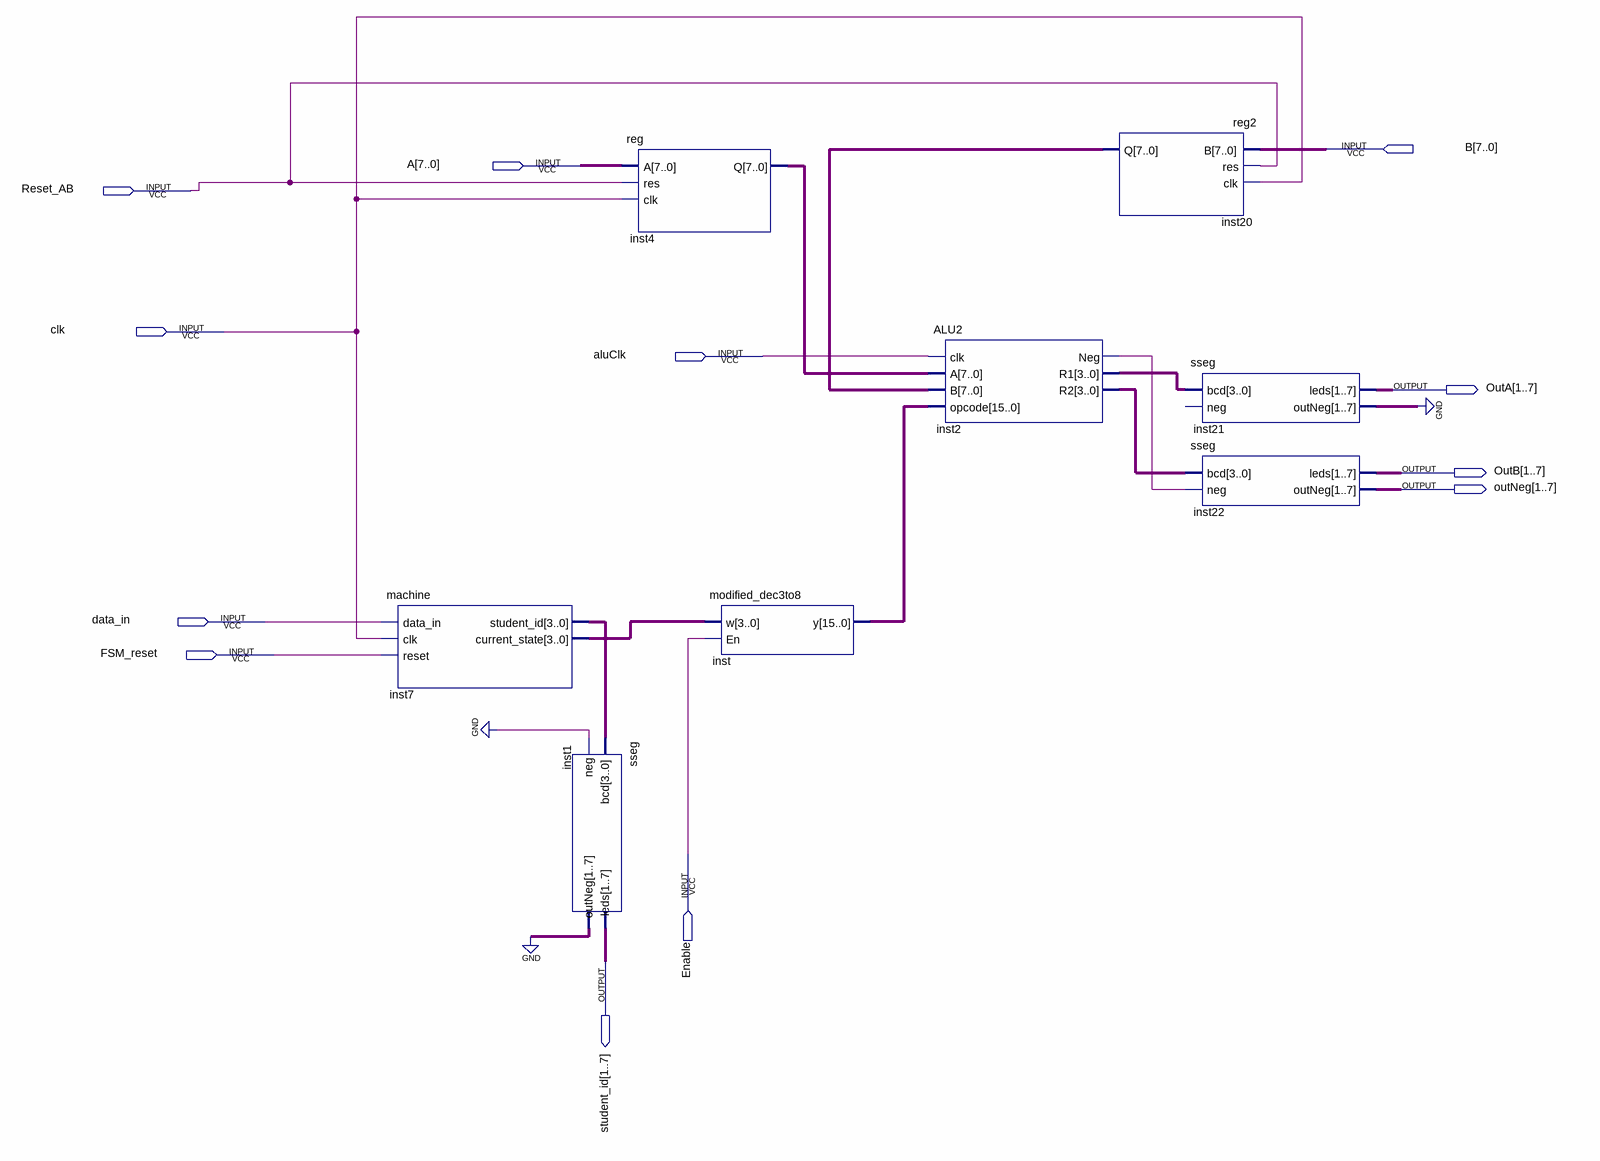
[diagram p0: schematic sheet]
// Quartus schematic ALU2BD.bdf as structural Verilog: 8 symbols, 12 pins
module ALU2BD (
  input  [7:0] B,
  input  [7:0] A,
  input  Reset_AB,
  input  clk,
  input  aluClk,
  input  data_in,
  input  FSM_reset,
  input  Enable,
  output [1:7] OutA,
  output [1:7] OutB,
  output [1:7] outNeg,
  output [1:7] student_id
);

  wire inst2_neg;
  wire [3:0] inst2_r1, inst2_r2, inst7_current_state, inst7_student_id;
  wire [6:0] inst1_outneg, inst21_outneg;
  wire [7:0] inst4_q, inst20_q;
  wire [15:0] inst_y;

  machine inst7 (
    .data_in(data_in), .clk(clk), .reset(FSM_reset), .student_id(inst7_student_id),
    .current_state(inst7_current_state));
  sseg inst1 (.bcd(inst7_student_id), .neg(1'b0), .leds(student_id), .outNeg(inst1_outneg));
  \reg  inst4 (.A(A), .res(Reset_AB), .clk(clk), .Q(inst4_q));
  modified_dec3to8 inst (.w(inst7_current_state), .En(Enable), .y(inst_y));
  ALU2 inst2 (.clk(aluClk), .A(inst4_q), .B(inst20_q), .opcode(inst_y), .Neg(inst2_neg), .R1(inst2_r1), .R2(inst2_r2));
  reg2 inst20 (.B(B), .res(Reset_AB), .clk(clk), .Q(inst20_q));
  sseg inst21 (.bcd(inst2_r1), .leds(OutA), .outNeg(inst21_outneg));  // open: neg
  sseg inst22 (.bcd(inst2_r2), .neg(inst2_neg), .leds(OutB), .outNeg(outNeg));
  // also tied to GND on the sheet: {inst21_outneg[0], inst21_outneg[1], inst21_outneg[2], inst21_outneg[3], inst21_outneg[4], inst21_outneg[5], inst21_outneg[6], inst1_outneg[0], inst1_outneg[1], inst1_outneg[2], inst1_outneg[3], inst1_outneg[4], inst1_outneg[5], inst1_outneg[6]}
endmodule
